# EasyEDA Pro project ProPrj_Segun O pcb_2026-03-03.epro, schematic 01POWER

## Sheets
1 01POWER: Board Name: 01POWER; Create Date: 2026-02-16; Page Name: 01POWER; Project Name: Segun O pcb fiverr; Schematic Name: 01POWER; Update Date: 2026-02-18
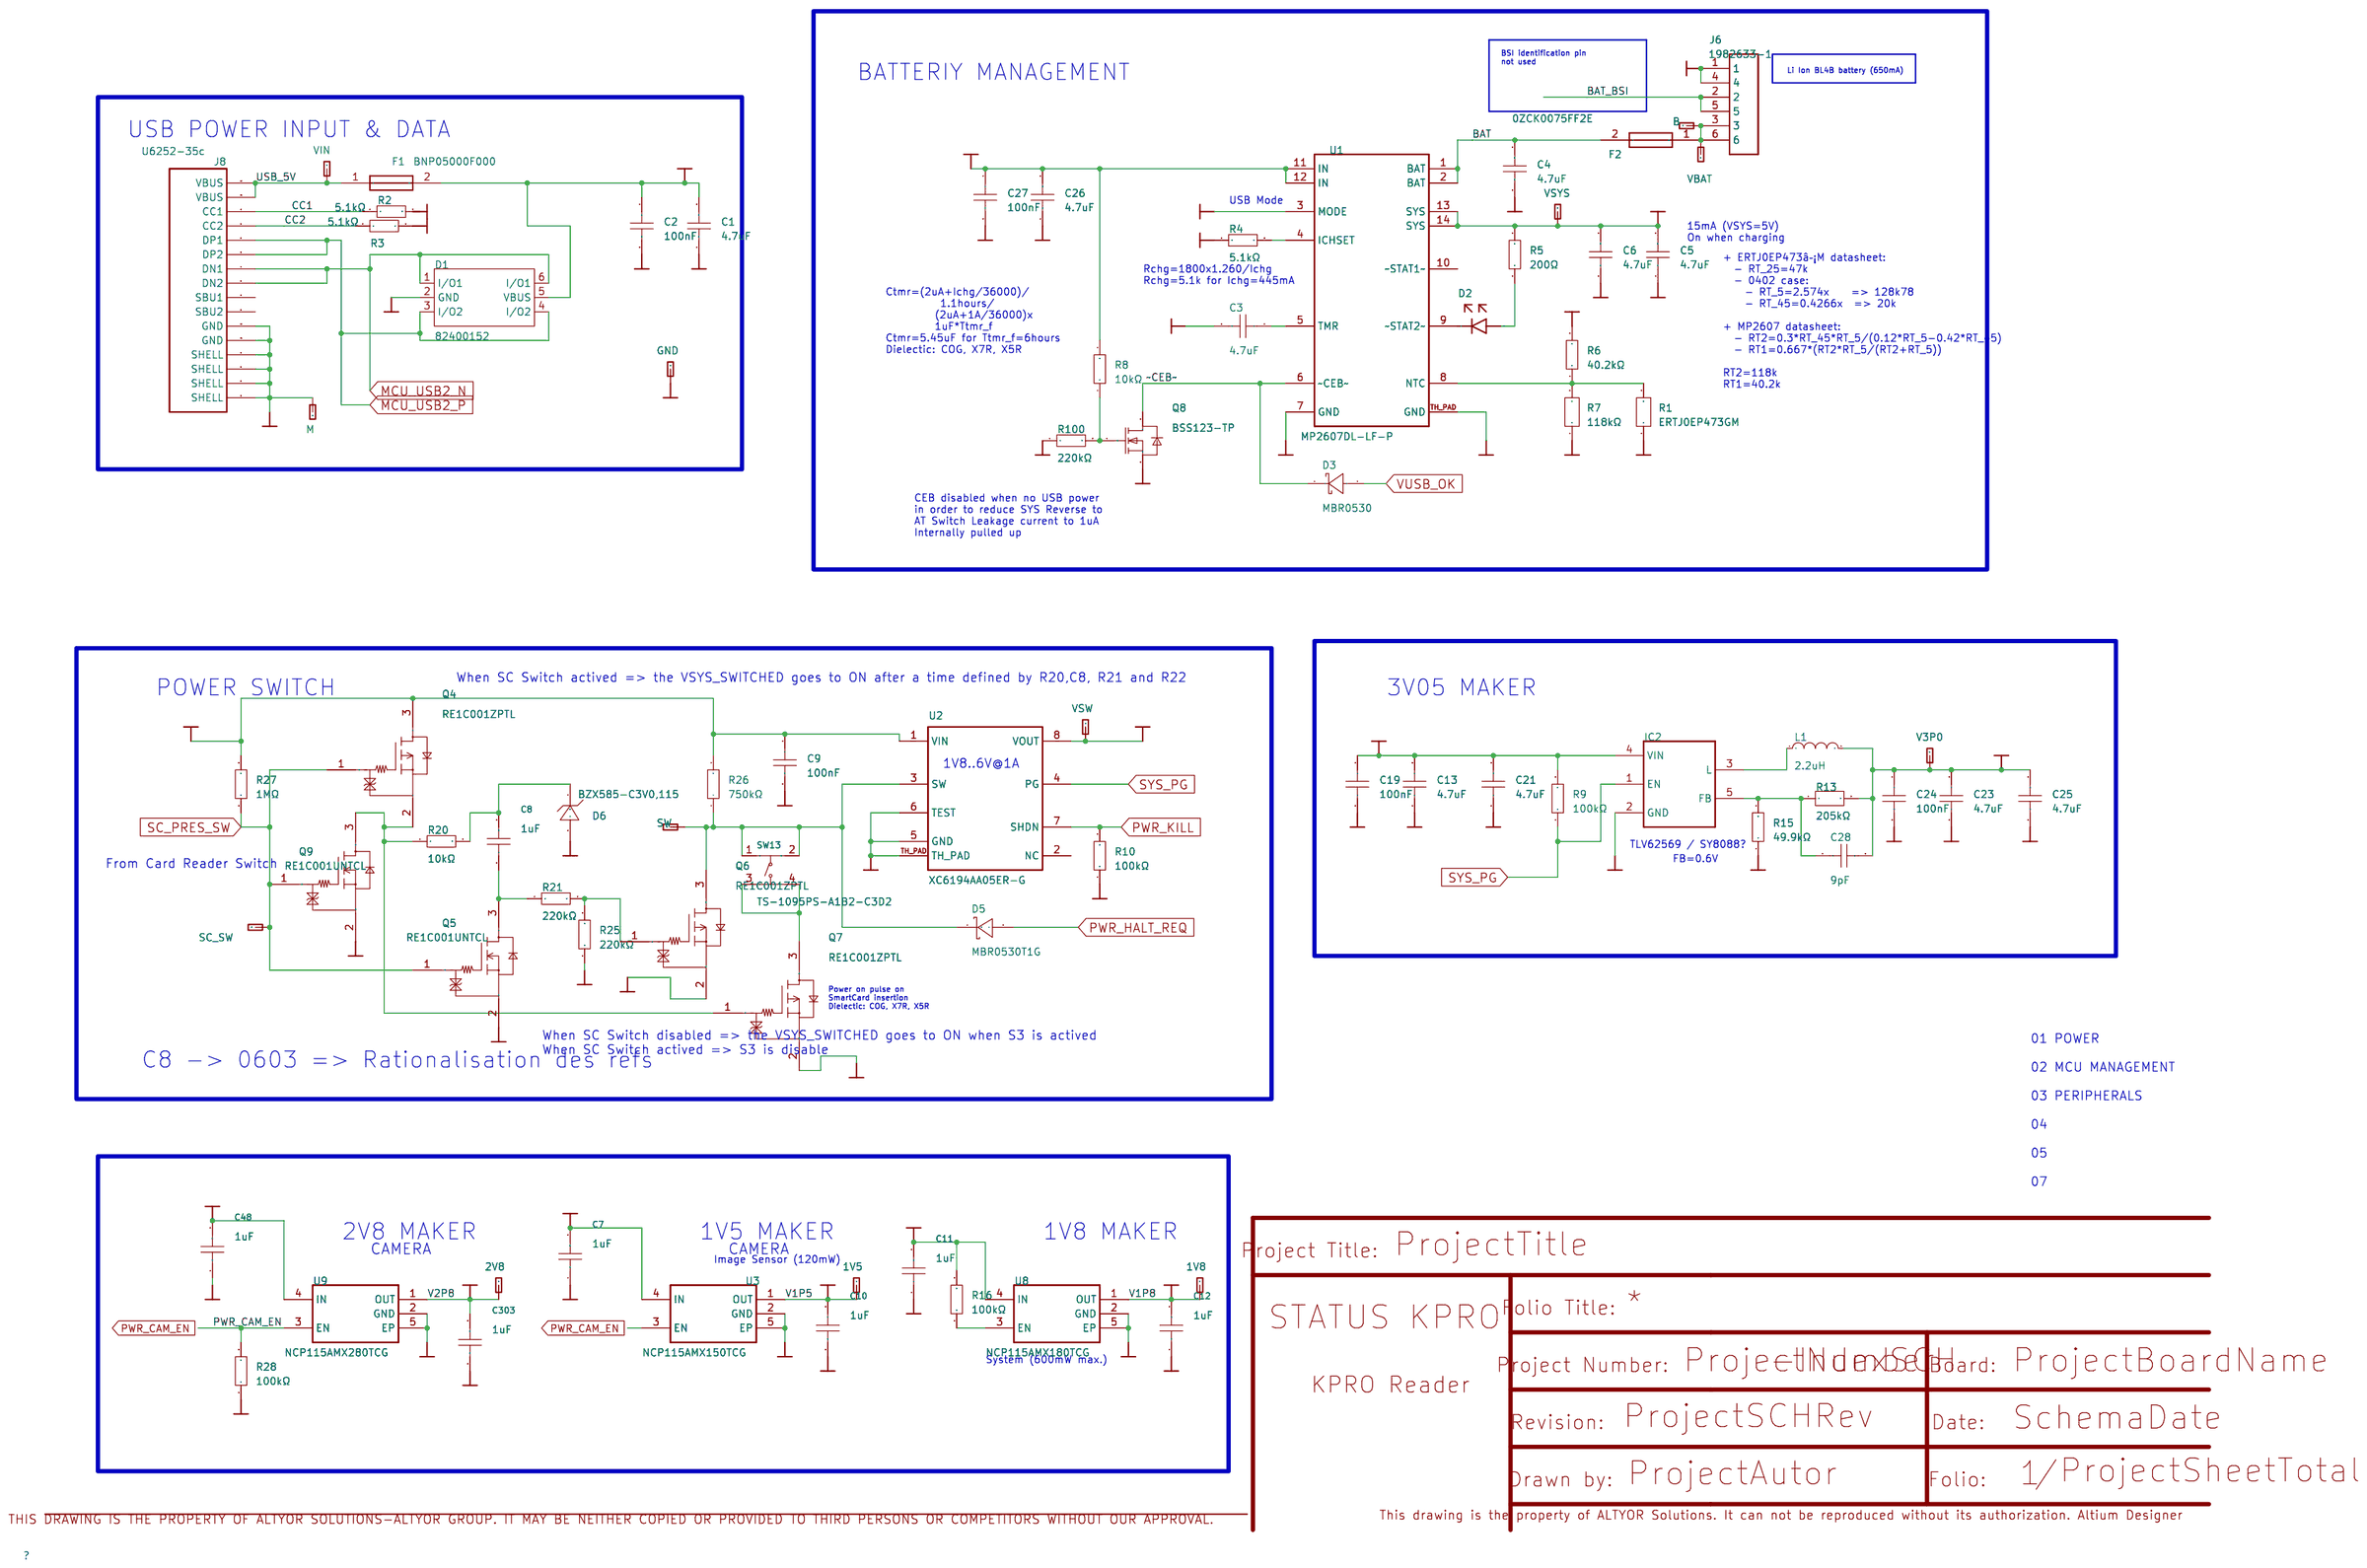
[diagram p0: 01POWER]
2 02MCU: Page Name: 02MCU; Update Date: 2026-02-16
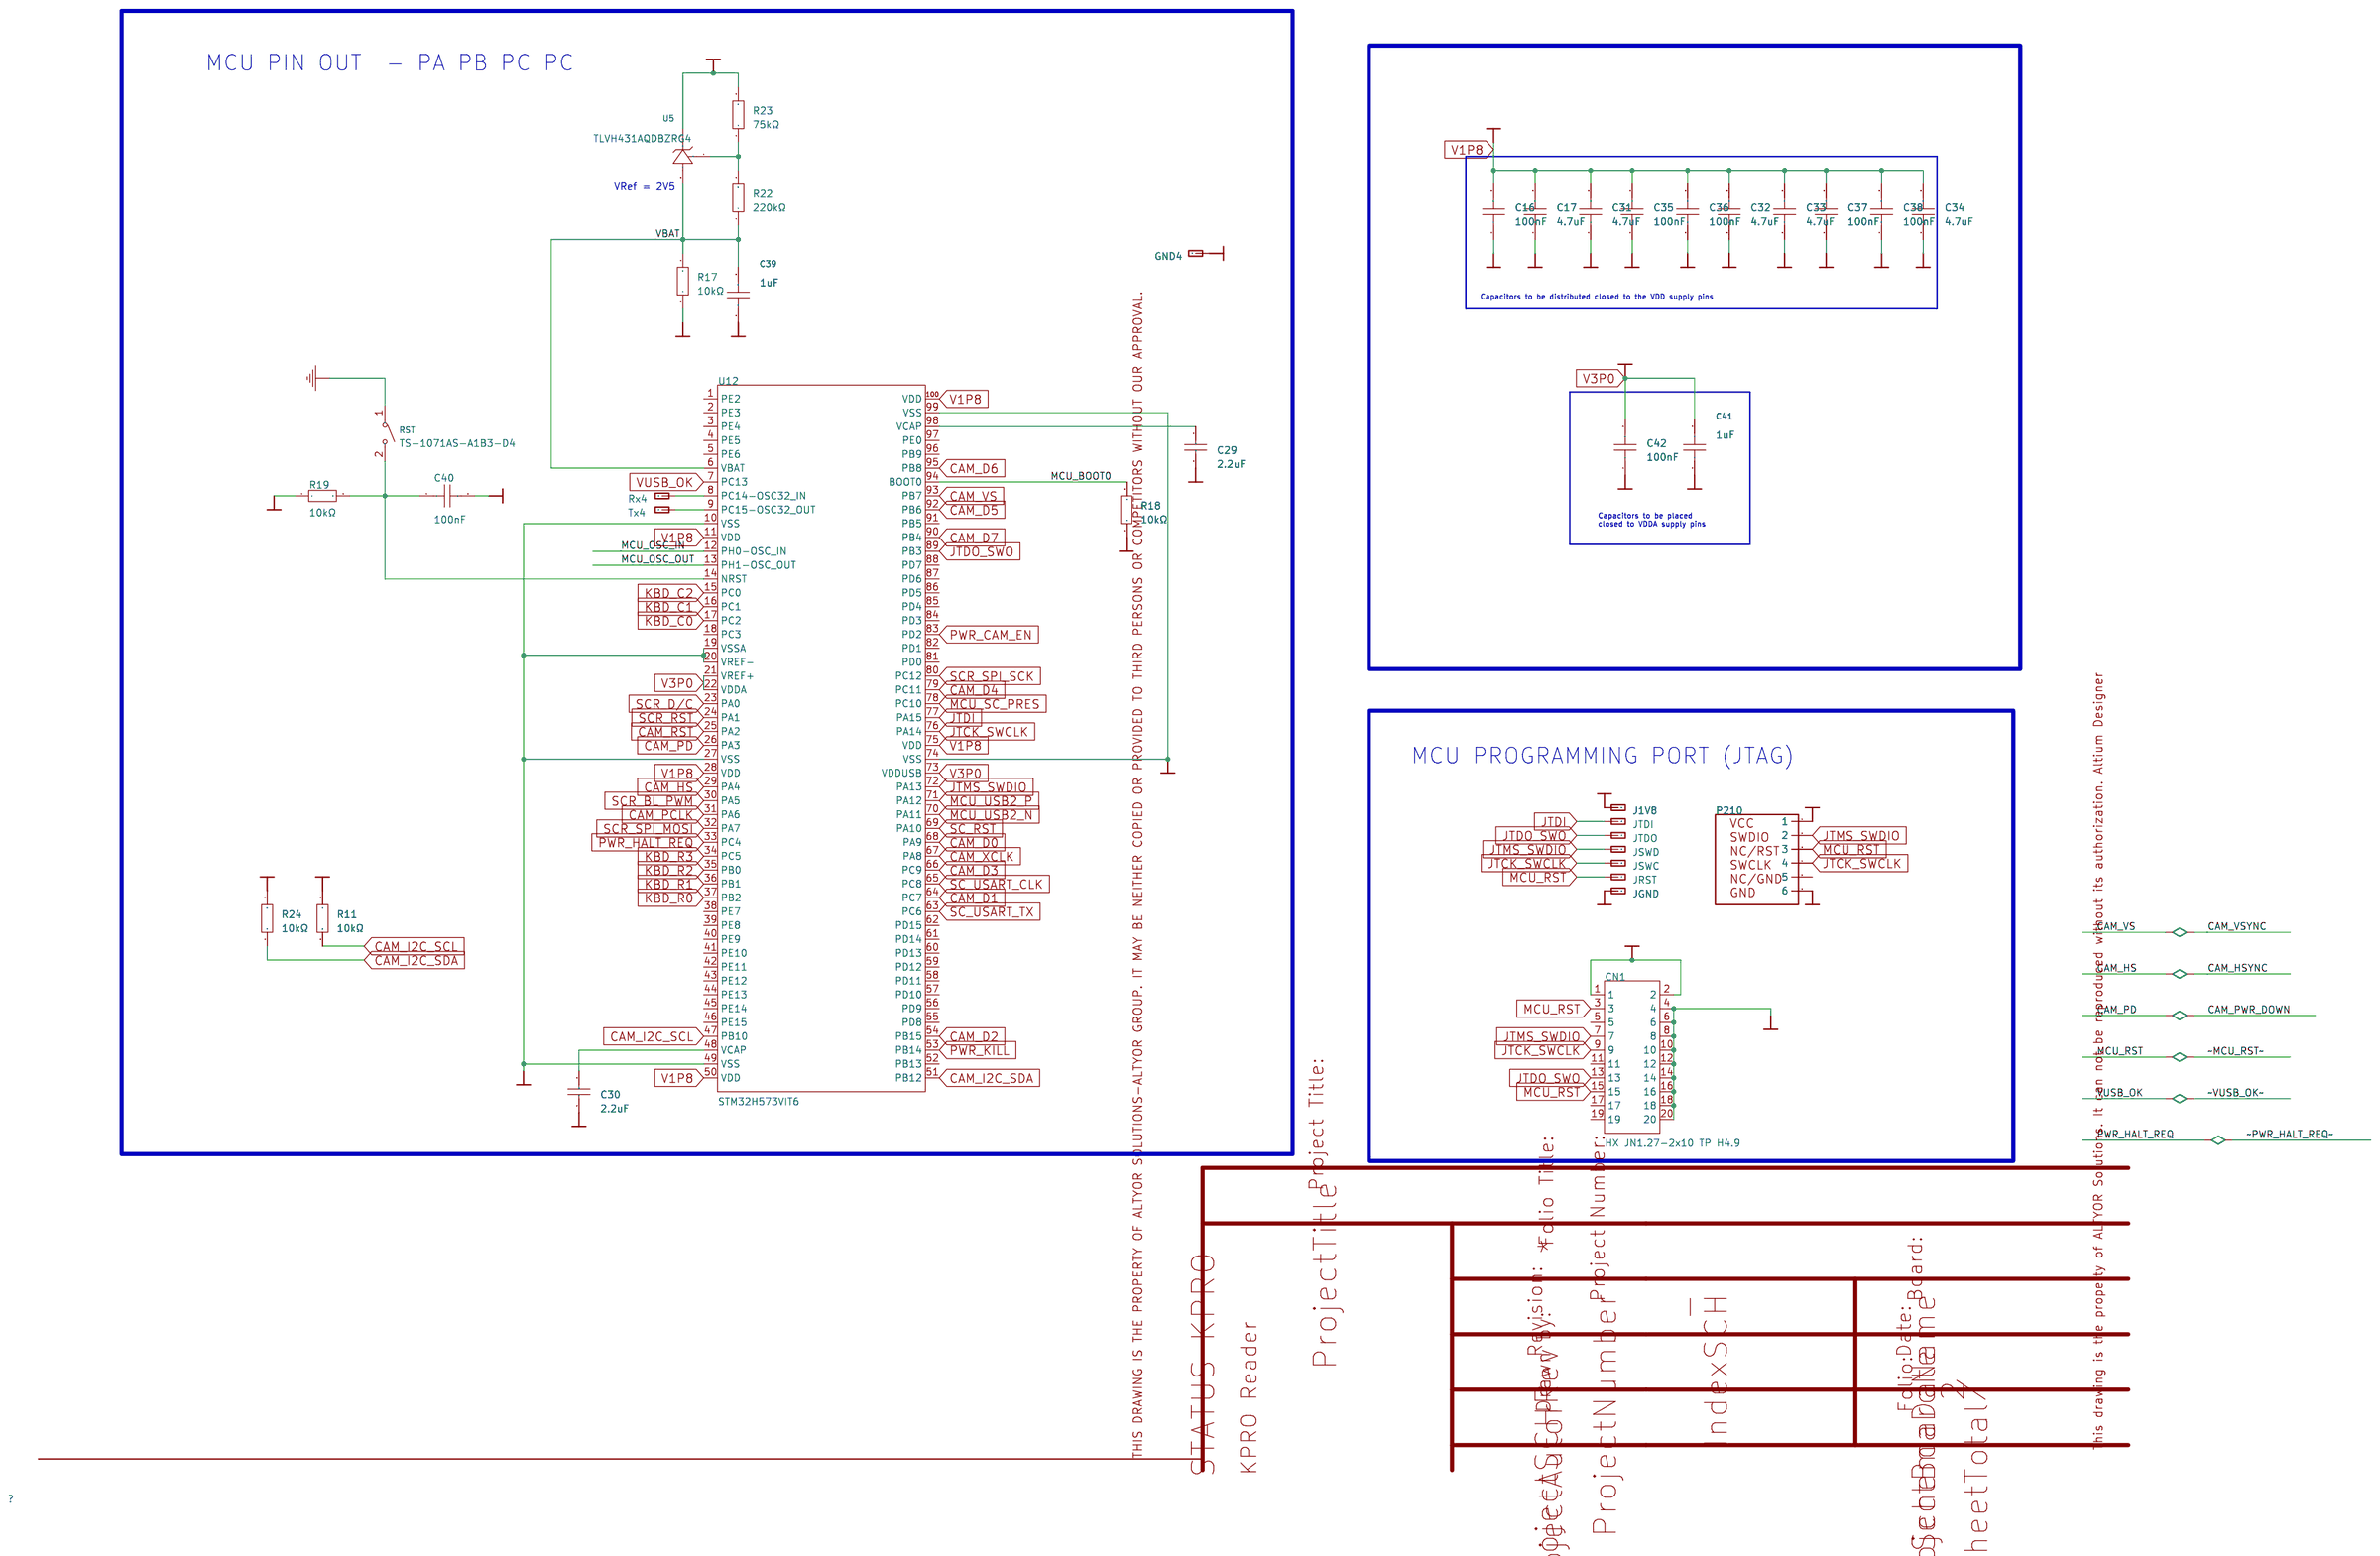
[diagram p1: 02MCU]
3 03PERIPHERALS: Page Name: 03PERIPHERALS
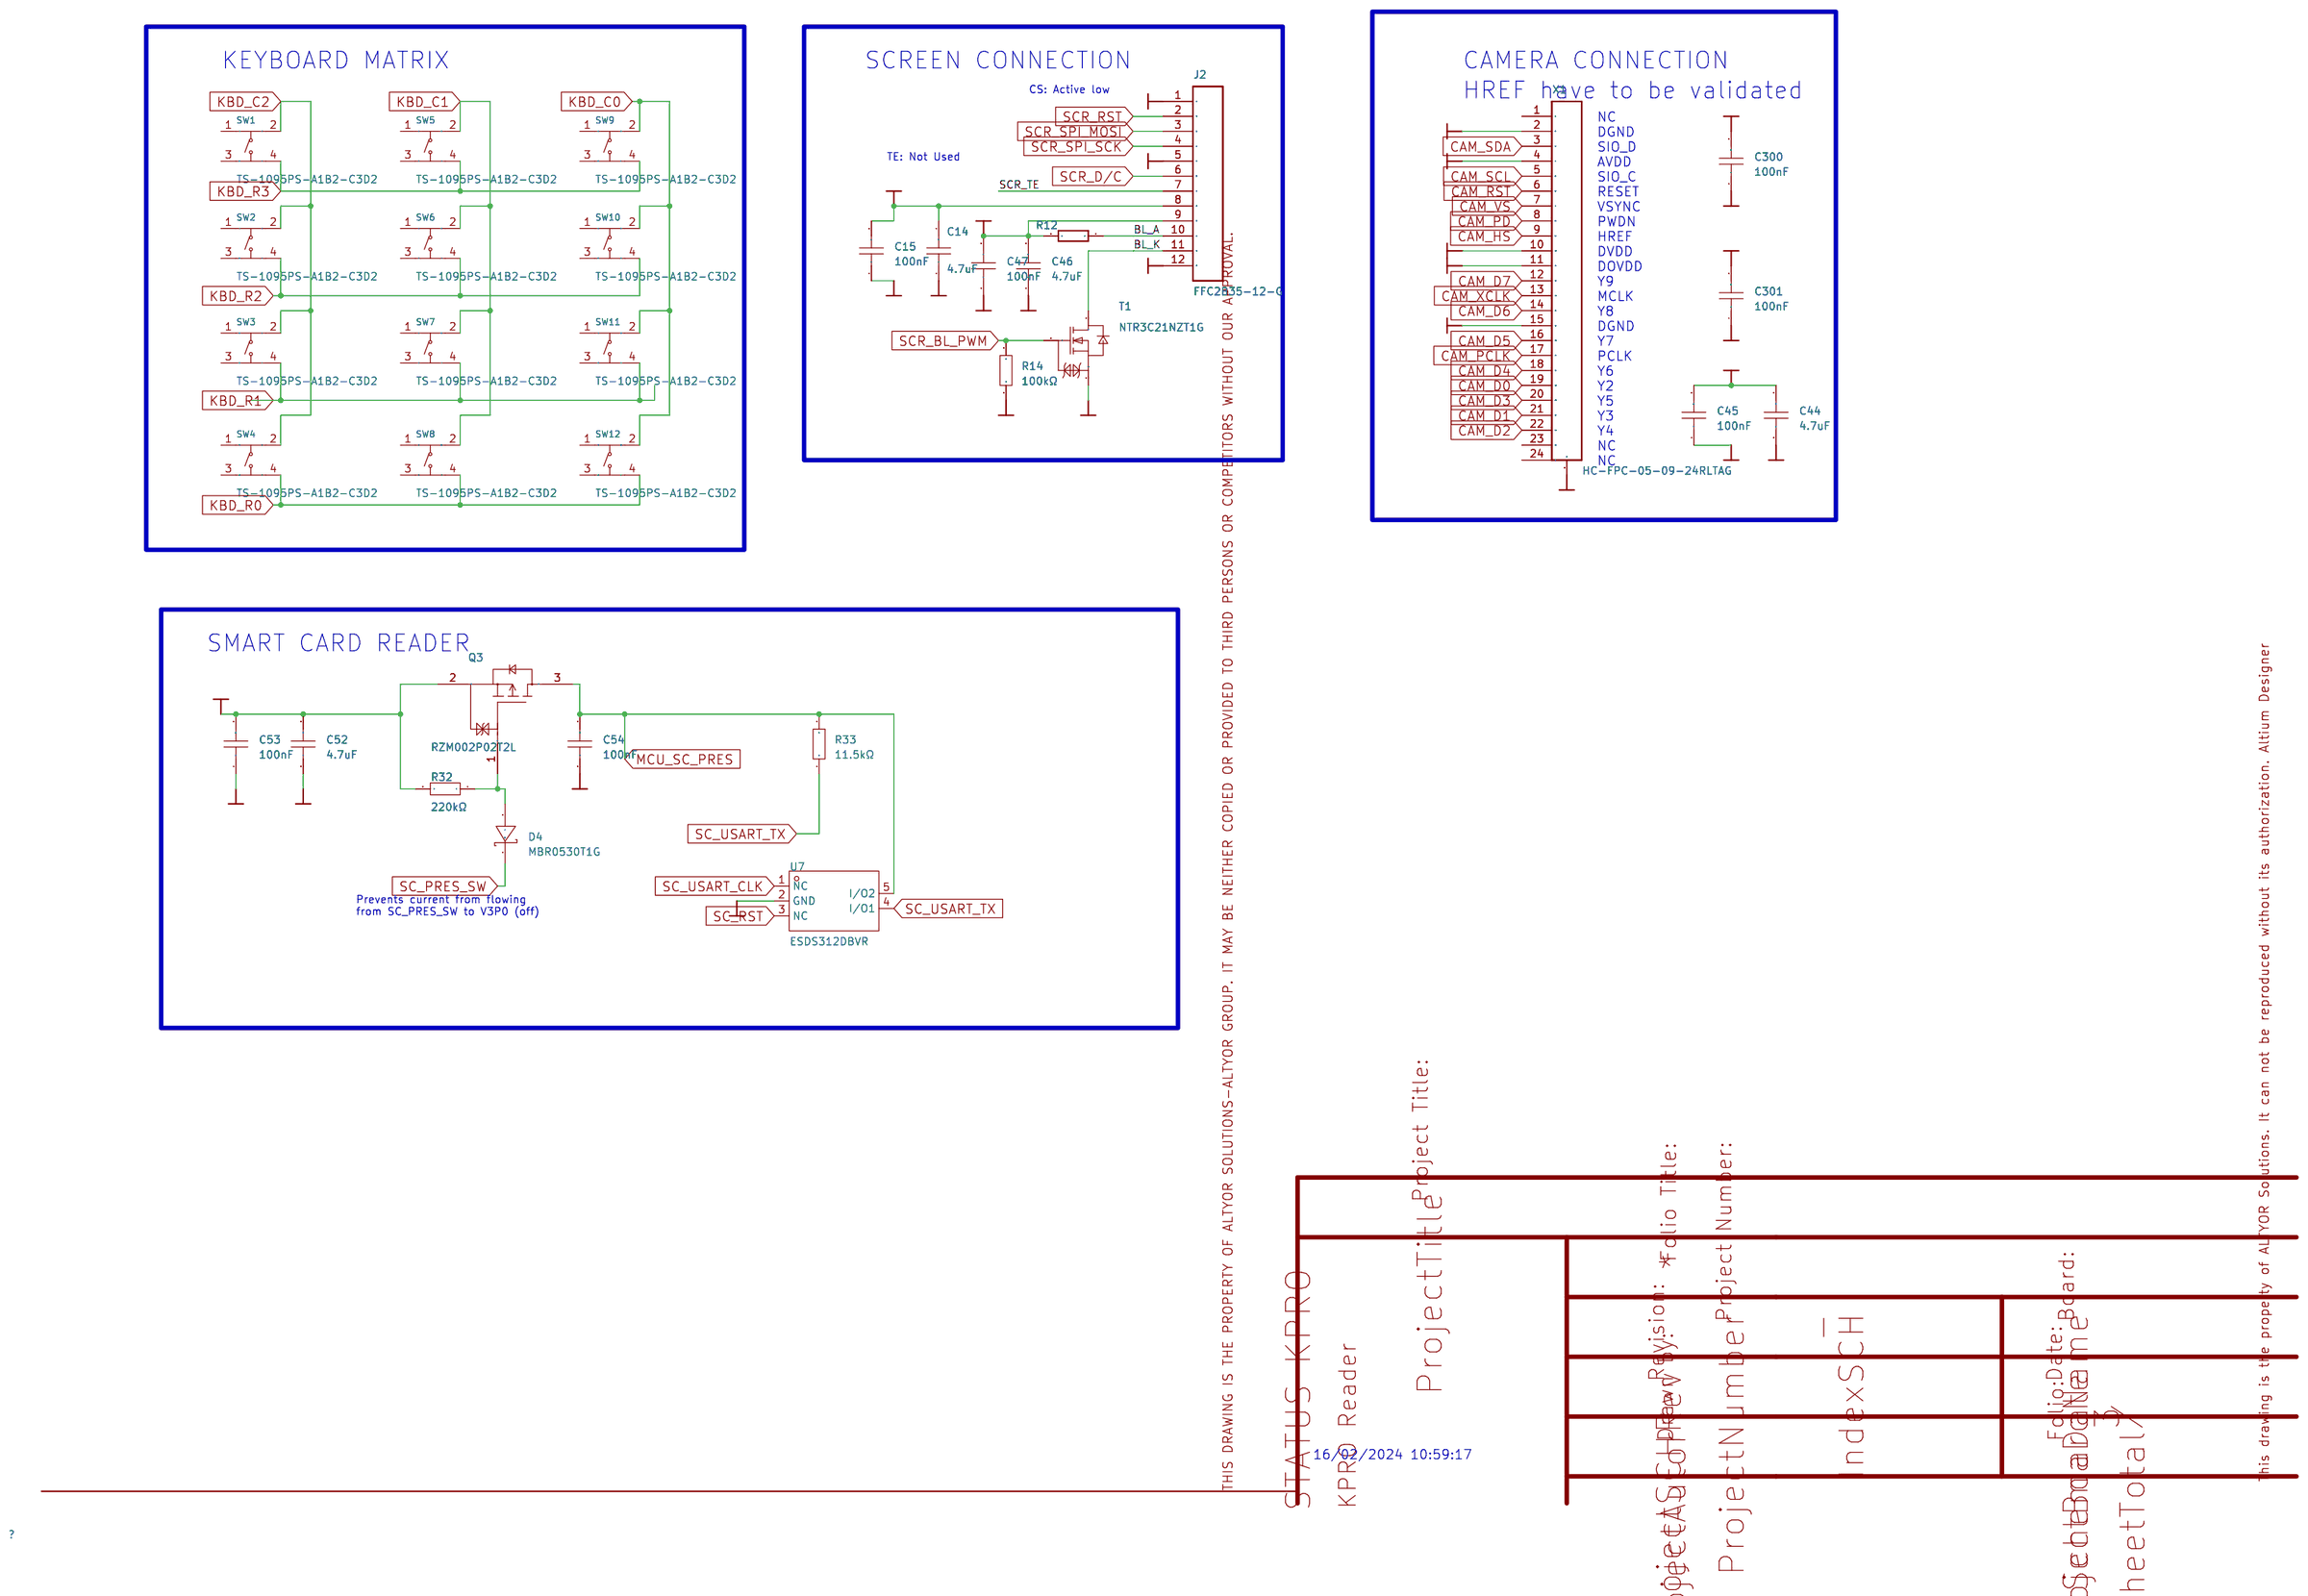
[diagram p2: 03PERIPHERALS]
4 Folio01: Page Name: Folio01
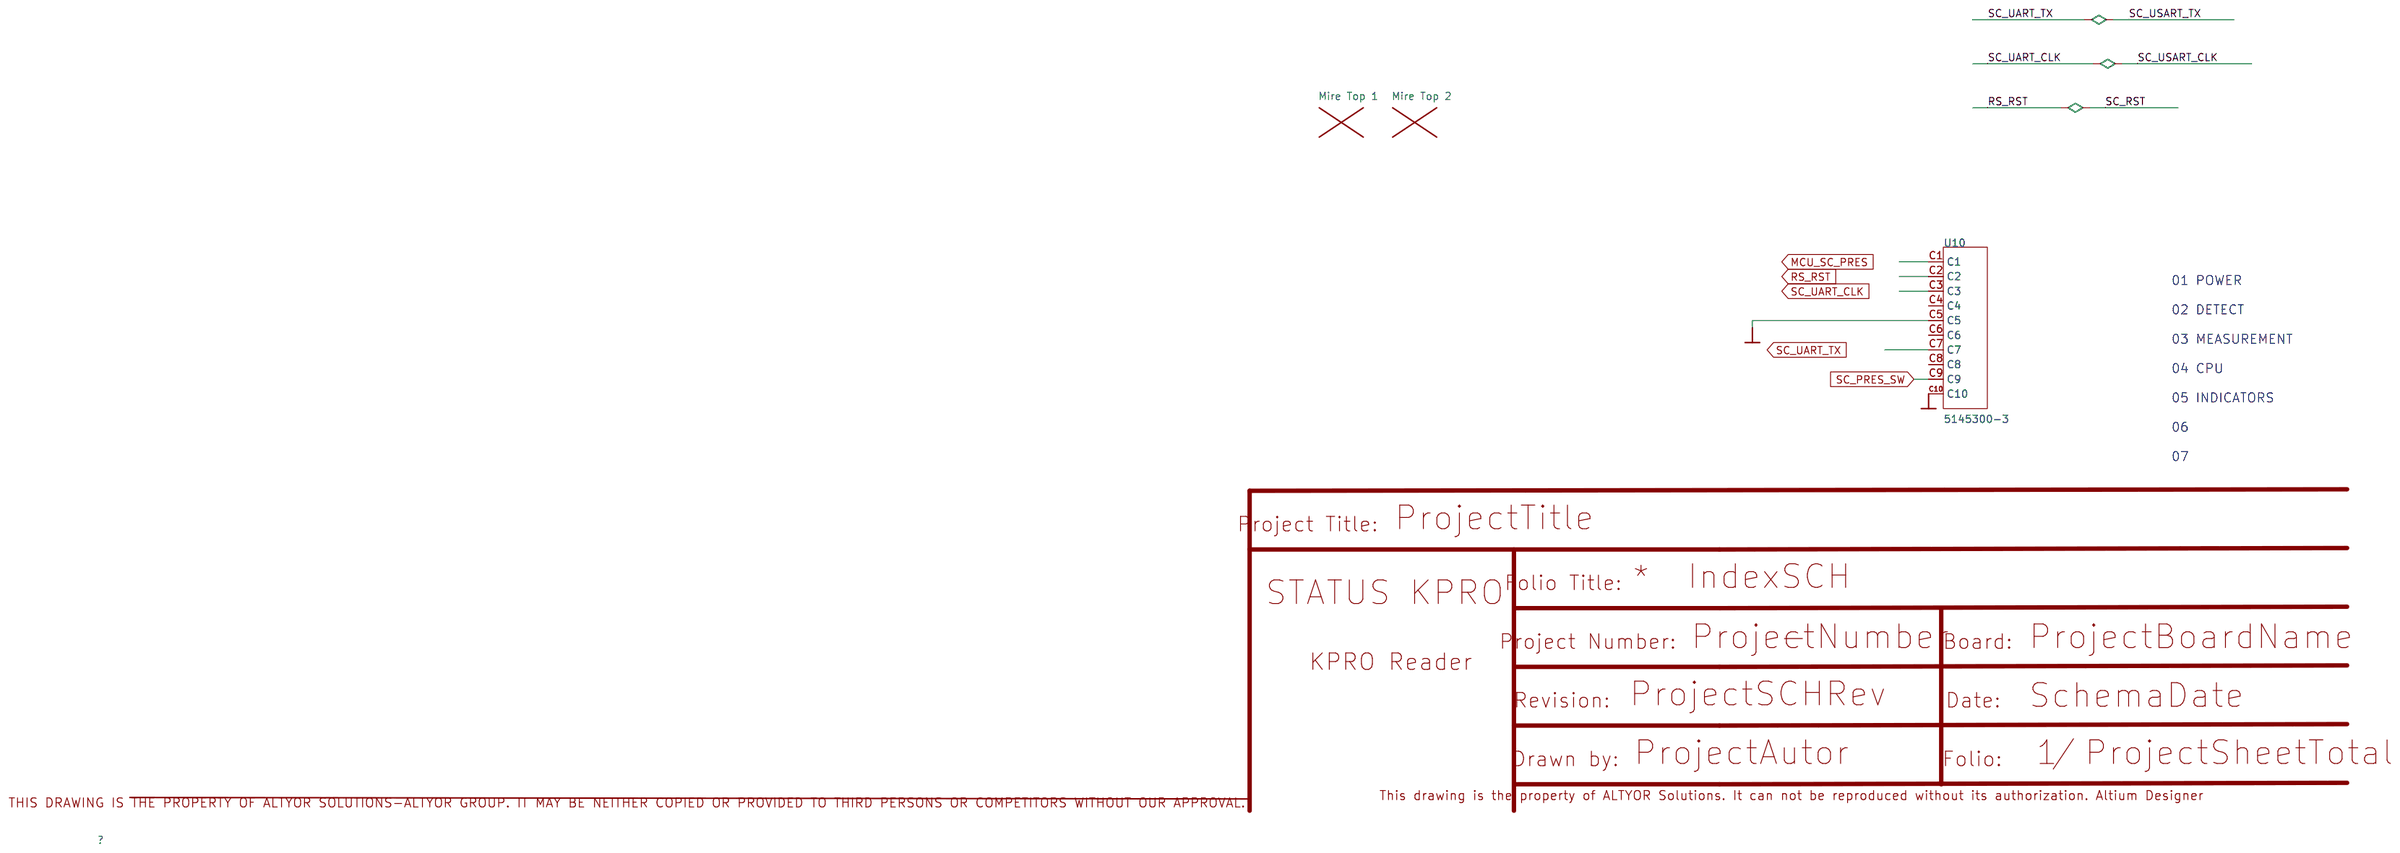
[diagram p3: Folio01]

## Parts
sheet 01POWER
1V5  TP  [TESTPOINT 1MM]
1V8  TP  [TESTPOINT 1MM]
2V8  TP  [TESTPOINT 1MM]
B  TP  [PLAGE - ROUGE]
C1  4.7uF  [C0805]
C2  100nF  [C0402]
C3  4.7uF  [C0402]
C4  4.7uF  [C0805]
C5  4.7uF  [C0805]
C6  4.7uF  [C0805]
C7  1uF  [C0603]
C8  1uF  [C0603]
C9  100nF  [C0402]
C10  1uF  [C0603]
C11  1uF  [C0603]
C12  1uF  [C0603]
C13  4.7uF  [C0805]
C19  100nF  [C0402]
C21  4.7uF  [C0805]
C23  4.7uF  [C0805]
C24  100nF  [C0402]
C25  4.7uF  [C0805]
C26  4.7uF  [C0805]
C27  100nF  [C0402]
C28  9pF  [C0402]
C48  1uF  [C0603]
C303  1uF  [C0603]
D1  82400152  [SOT-563_L1.6-W1.2-P0.50-LS1.6-BL]
D2  LR_Y8SF-U1V2-1  [OSRAM LRY8SFU1V21]
D3  MBR0530  [SOD-123_L2.7-W1.6-LS3.7-RD-1]
D5  MBR0530T1G  [SOD-123_L2.7-W1.6-LS3.7-RD-1]
D6  BZX585-C3V0,115  [SOD-523_L1.2-W0.8-LS1.6-RD]
F1  BNP05000F000  [0805 - FUSE]
F2  0ZCK0075FF2E  [0805 - FUSE]
GND  TP  [TESTPOINT 1MM]
IC2  SY8088IAAC  [SOT23-5 0.95 VAR AA]
J6  1982633-1  [TE 19826331]
J8  U6252-35c  [ANTENK U6252-35C]
L1  2.2uH  [IND-SMD_L2.5-W2.0-1]
M  TP  [PLAGE - NOIRE]
Q4  RE1C001ZPTL  [SC-89-3_L1.6-W0.9-P1.00-LS1.6-BR]
Q5  RE1C001UNTCL  [SC-89-3_L1.6-W0.9-P1.00-LS1.6-BR]
Q6  RE1C001ZPTL  [SC-89-3_L1.6-W0.9-P1.00-LS1.6-BR]
Q7  RE1C001ZPTL  [SC-89-3_L1.6-W0.9-P1.00-LS1.6-BR]
Q8  BSS123-TP  [SOT-23-3_L2.9-W1.3-P0.95-LS2.4-BR]
Q9  RE1C001UNTCL  [SC-89-3_L1.6-W0.9-P1.00-LS1.6-BR]
R1  ERTJ0EP473GM  [R0402]
R2  5.1kΩ  [R0402]
R3  5.1kΩ  [R0402]
R4  5.1kΩ  [R0402]
R5  200Ω  [R0402]
R6  40.2kΩ  [R0402]
R7  118kΩ  [R0402]
R8  10kΩ  [R0402]
R9  100kΩ  [R0402]
R10  100kΩ  [R0402]
R13  205kΩ  [R0402]
R15  49.9kΩ  [R0402]
R16  100kΩ  [R0402]
R20  10kΩ  [R0402]
R21  220kΩ  [R0402]
R25  220kΩ  [R0402]
R26  750kΩ  [R0402]
R27  1MΩ  [R0201]
R28  100kΩ  [R0402]
R100  220kΩ  [R0402]
SC_SW  TP  [TESTPOINT 1MM]
SW  TP  [TESTPOINT 1MM]
SW13  TS-1095PS-A1B2-C3D2  [KEY-SMD_4P-L6.0-W6.0-P3.90-LS9.0]
U1  MP2607DL-LF-P  [QFN14-0.5-3S4]
U2  XC6194AA05ER-G  [TOREX USP-8B06]
U3  NCP115AMX150TCG  [ON SEMI NCV8160AMX330TBG]
U8  NCP115AMX180TCG  [ON SEMI NCV8160AMX330TBG]
U9  NCP115AMX280TCG  [ON SEMI NCV8160AMX330TBG]
V3P0  TP  [TESTPOINT 1MM]
VBAT  TP  [TESTPOINT 1MM]
VIN  TP  [TESTPOINT 1MM]
VSW  TP  [TESTPOINT 1MM]
VSYS  TP  [TESTPOINT 1MM]
sheet 02MCU
C16  100nF  [C0402]
C17  4.7uF  [C0805]
C29  2.2uF  [C0805]
C30  2.2uF  [C0805]
C31  4.7uF  [C0805]
C32  4.7uF  [C0805]
C33  4.7uF  [C0805]
C34  4.7uF  [C0805]
C35  100nF  [C0402]
C36  100nF  [C0402]
C37  100nF  [C0402]
C38  100nF  [C0402]
C39  1uF  [C0603]
C40  100nF  [C0402]
C41  1uF  [C0603]
C42  100nF  [C0402]
CN1  HX JN1.27-2x10 TP H4.9  [CONN-SMD_HX-JN1.27-2X10-TP-H4.9]
GND4  TP  [TESTPOINT 1MM]
J1V8  TP  [TESTPOINT 1MM]
JGND  TP  [TESTPOINT 1MM]
JRST  TP  [TESTPOINT 1MM]
JSWC  TP  [TESTPOINT 1MM]
JSWD  TP  [TESTPOINT 1MM]
JTDI  TP  [TESTPOINT 1MM]
JTDO  TP  [TESTPOINT 1MM]
P210  TC2030-MCP-NL  [TC2030-MCP-NL]
R11  10kΩ  [R0402]
R17  10kΩ  [R0402]
R18  10kΩ  [R0402]
R19  10kΩ  [R0402]
R22  220kΩ  [R0402]
R23  75kΩ  [R0402]
R24  10kΩ  [R0402]
RST  TS-1071AS-A1B3-D4  [SW-SMD_L4.0-W3.0-LS4.8]
Rx4  TP  [TESTPOINT 1MM]
Tx4  TP  [TESTPOINT 1MM]
U5  TLVH431AQDBZRG4  [SOT-23-3_L3.0-W1.7-P0.95-LS2.9-BR]
U12  STM32H573VIT6  [LQFP-100_L14.0-W14.0-P0.50-LS16.0-BL]
sheet 03PERIPHERALS
C14  4.7uF  [C0805]
C15  100nF  [C0402]
C44  4.7uF  [C0805]
C45  100nF  [C0402]
C46  4.7uF  [C0805]
C47  100nF  [C0402]
C52  4.7uF  [C0805]
C53  100nF  [C0402]
C54  100nF  [C0402]
C300  100nF  [C0402]
C301  100nF  [C0402]
D4  MBR0530T1G  [SOD-123_L2.7-W1.6-LS3.7-RD-1]
J2  FFC2B35-12-G  [GCT FFC2B35-12-G]
Q3  RZM002P02T2L  [SOT-723_L1.2-W0.8-P0.40-LS1.2-BR]
R12  RC0402FR-0710RL  [0402 - RESISTOR]
R14  100kΩ  [R0402]
R32  220kΩ  [R0402]
R33  11.5kΩ  [R0402]
SW1  TS-1095PS-A1B2-C3D2  [KEY-SMD_4P-L6.0-W6.0-P3.90-LS9.0]
SW2  TS-1095PS-A1B2-C3D2  [KEY-SMD_4P-L6.0-W6.0-P3.90-LS9.0]
SW3  TS-1095PS-A1B2-C3D2  [KEY-SMD_4P-L6.0-W6.0-P3.90-LS9.0]
SW4  TS-1095PS-A1B2-C3D2  [KEY-SMD_4P-L6.0-W6.0-P3.90-LS9.0]
SW5  TS-1095PS-A1B2-C3D2  [KEY-SMD_4P-L6.0-W6.0-P3.90-LS9.0]
SW6  TS-1095PS-A1B2-C3D2  [KEY-SMD_4P-L6.0-W6.0-P3.90-LS9.0]
SW7  TS-1095PS-A1B2-C3D2  [KEY-SMD_4P-L6.0-W6.0-P3.90-LS9.0]
SW8  TS-1095PS-A1B2-C3D2  [KEY-SMD_4P-L6.0-W6.0-P3.90-LS9.0]
SW9  TS-1095PS-A1B2-C3D2  [KEY-SMD_4P-L6.0-W6.0-P3.90-LS9.0]
SW10  TS-1095PS-A1B2-C3D2  [KEY-SMD_4P-L6.0-W6.0-P3.90-LS9.0]
SW11  TS-1095PS-A1B2-C3D2  [KEY-SMD_4P-L6.0-W6.0-P3.90-LS9.0]
SW12  TS-1095PS-A1B2-C3D2  [KEY-SMD_4P-L6.0-W6.0-P3.90-LS9.0]
T1  NTR3C21NZT1G  [SOT-23-3_L2.9-W1.6-P1.90-LS2.8-BR]
U7  ESDS312DBVR  [SOT-23-5_L2.9-W1.6-P0.95-LS2.8-TL]
X1  HC-FPC-05-09-24RLTAG  [HCTL HC-FPC-05-09-24RLTAG]
sheet Folio01
Mire Top 1  DNI  [MIRE]
Mire Top 2  DNI  [MIRE]
U10  5145300-3  [SD-SMD_5145300-3]

## Library data of the parts
1V5 1V8 2V8 B GND GND4 J1V8 JGND JRST JSWC JSWD JTDI JTDO M Rx4 SC_SW SW Tx4 V3P0 VBAT VIN VSW VSYS = TP: Pointe de test 1.27mm; LIBRARY REFERENCE: TP 1.27mm; ERP CODE: 10-*; ERP SF CODE: 16; TMAX: N/A; TMIN: N/A; GENERIC: False; Library Name: KCP-2282-600
C1 C4-C6 C13 C14 C17 C21 C23 C25 C26 C31-C34 C44 C46 C52 = 0805X475M250NT: Capacitance:4.7uF Tolerance:±20% Tolerance:±20% Voltage Rating:25V Temperature Coefficient:X5R; LCSC Part Name: 4.7uF ±20% 25V; Supplier Part: C2857998; Manufacturer: FH(风华); Supplier Footprint: 0805; JLCPCB Part Class: Extended Part; Datasheet: https://item.szlcsc.com/datasheet/0805X475M250NT/3058809.html; Supplier: LCSC; Tolerance: ±20%; Voltage Rating: 25V; Temperature Coefficient: X5R
C2 C9 C15 C16 C19 C24 C27 C35-C38 C40 C42 C45 C47 C53 C54 C300 C301 = 0402B104K500CT: Capacitance:100nF Tolerance:±10% Tolerance:±10% Voltage Rating:50V Temperature Coefficient:X7R; LCSC Part Name: 100nF ±10% 50V; Supplier Part: C152814; Manufacturer: Walsin(华新科); Supplier Footprint: 0402; Datasheet: https://item.szlcsc.com/datasheet/0402B104K500CT/164155.html; Supplier: LCSC; Tolerance: ±10%; Voltage Rating: 50V; Temperature Coefficient: X7R
C3 = CC0402KRX5R6BB475: Capacitance:4.7uF Tolerance:±10% Tolerance:±10% Voltage Rating:10V Temperature Coefficient:X5R; LCSC Part Name: 4.7uF ±10% 10V; Supplier Part: C326586; Manufacturer: YAGEO(国巨); Supplier Footprint: 0402; Datasheet: https://item.szlcsc.com/datasheet/CC0402KRX5R6BB475/306680.html; Supplier: LCSC; Tolerance: ±10%; Voltage Rating: 10V; Temperature Coefficient: X5R
C7 C8 C10-C12 C39 C41 C48 C303 = 0603X105K500CT: Capacitance: Tolerance:±10% Tolerance:±10% Voltage Rated: Temperature Coefficient:; LCSC Part Name: 1uF ±10% 50V; Supplier Part: C141872; Manufacturer: Walsin(华新科); Supplier Footprint: 0603; Datasheet: https://atta.szlcsc.com/upload/public/pdf/source/20181012/C171757_24195D90CC6BA860ED294A8E1EED20EE.pdf; Supplier: LCSC; Tolerance: ±10%
C28 = GJM1555C1H9R0CB01D: Capacitance:9pF Voltage Rating:50V Temperature Coefficient:C0G; LCSC Part Name: ±0.25pF 9pF 50V; Supplier Part: C85884; Manufacturer: muRata(村田); Supplier Footprint: 0402; Datasheet: https://item.szlcsc.com/datasheet/GJM1555C1H9R0CB01D/87060.html; Supplier: LCSC; Voltage Rating: 50V; Temperature Coefficient: C0G
D1 = 82400152_C22435121: Reverse Stand-Off Voltage (Vrwm):5V Clamping Voltage:16V Peak Pulse Current (Ipp):5A@8/20us Peak Pulse Power Dissipation (Ppp):100W@8/20us Voltage - Breakdown:6.5V Reverse Leakage Current (Ir):100nA level of protection:IEC 61000-4-2；IEC 61000-4-4；IEC 6100; LCSC Part Name: 低电容TVS二极管阵列; Supplier Part: C22435121; Manufacturer: TECH PUBLIC(台舟); Supplier Footprint: SOT-563; JLCPCB Part Class: Extended Part; Datasheet: https://item.szlcsc.com/datasheet/82400152/24062289.html; Supplier: LCSC; Reverse Stand-Off Voltage (Vrwm): 5V; Clamping Voltage: 16V; Peak Pulse Current (Ipp): 5A@8/20us; Peak Pulse Power Dissipation (Ppp): 100W@8/20us; Voltage - Breakdown: 6.5V; Reverse Leakage Current (Ir): 100nA; level of protection: IEC 61000-4-2；IEC 61000-4-4；IEC 61000-4-5; Junction Capacitance: 0.8pF；0.3pF
D2 = LR_Y8SF-U1V2-1: Osram Opto Micro SIDELED Series Red LED, 120    Source:  Datasheet; TMIN: -40; TMAX: 100; ARTICLE CODE: MSR 720-LRY8SFU1V21; ERP CODE: 10-*; ERP SF CODE: 5; MANUFACTURER: OSRAM; GENERIC: Flase; Library Name: KCP-2282-600
D3 = MBR0530_C699108: Voltage - Forward(Vf@If):550mV@500mA Voltage - DC Reverse(Vr):30V Current - Rectified:500mA Reverse Leakage Current (Ir):100uA@30V Operating Junction Temperature Range:-55℃~+125℃ Operating Junction Temperature Range:-55℃~+125℃ Non-Repetitive Peak Forward; LCSC Part Name: 电压:30V 电流:500mA; Supplier Part: C699108; Manufacturer: YANGJIE(扬杰); Supplier Footprint: SOD-123; JLCPCB Part Class: Extended Part; Datasheet: https://item.szlcsc.com/datasheet/MBR0530/733800.html; Supplier: LCSC; Voltage - Forward(Vf@If): 550mV@500mA; Voltage - DC Reverse(Vr): 30V; Current - Rectified: 500mA; Reverse Leakage Current (Ir): 100uA@30V; Operating Junction Temperature Range: -55℃~+125℃; Non-Repetitive Peak Forward Surge Current: 5.5A
D4 D5 = MBR0530T1G: Voltage - Forward(Vf@If):430mV@500mA Voltage - DC Reverse(Vr):30V Current - Rectified:500mA Reverse Leakage Current (Ir):130uA@30V Operating Junction Temperature Range:-65℃~+125℃ Operating Junction Temperature Range:-65℃~+125℃ Non-Repetitive Peak Forward; LCSC Part Name: 电压:30V 电流:500mA; Supplier Part: C82046; Manufacturer: onsemi(安森美); Supplier Footprint: SOD-123; JLCPCB Part Class: Extended Part; Datasheet: https://item.szlcsc.com/datasheet/MBR0530T1G/83201.html; Supplier: LCSC; Voltage - Forward(Vf@If): 430mV@500mA; Voltage - DC Reverse(Vr): 30V; Current - Rectified: 500mA; Reverse Leakage Current (Ir): 130uA@30V; Operating Junction Temperature Range: -65℃~+125℃; Non-Repetitive Peak Forward Surge Current: 5.5A
D6 = BZX585-C3V0,115: Diode Configuration:1 Independent Zener Voltage(Nom):3V Reverse Leakage Current (Ir):10uA@1V Zener Voltage(Range):2.85V~3.15V Zener Voltage(Range):2.85V~3.15V Pd - Power Dissipation:300mW Impedance(Zzt):95Ω Operating Junction Temperature Range:-65℃~+150℃; LCSC Part Name: 稳压二极管; Supplier Part: C550648; Manufacturer: Nexperia(安世); Supplier Footprint: SOD-523(SC-79); JLCPCB Part Class: Extended Part; Datasheet: https://item.szlcsc.com/datasheet/BZX585-C3V0%252C115/571729.html; Supplier: LCSC; Diode Configuration: 1 Independent; Zener Voltage(Nom): 3V; Reverse Leakage Current (Ir): 10uA@1V; Zener Voltage(Range): 2.85V~3.15V; Pd - Power Dissipation: 300mW; Impedance(Zzt): 95Ω; Operating Junction Temperature Range: -65℃~+150℃
F1 = BNP05000F000: FUSE 500mA 6V 0805; MANUFACTURE_CND: '0ZCK0050FF2E/0402L050SLKR; ARTICLE CODE: 530-0ZCK0050FF2E; TMIN: -40; ERP CODE: 10-*; MANUFACTURER: JNHONGBAO; GENERIC: False; TMAX: 85; Design Item ID: 0ZCK0050FF2E; Library Name: KCP-2282-600
F2 = 0ZCK0075FF2E: PTC Resettable Fuse 0.75A(hold) 1.5A(trip) 6VDC 40A 0.6W 0.2s 0.09Ohm SMD Solder Pad 0805 T/R Automotive   Source:  Datasheet; TMIN: -40; TMAX: 85; ARTICLE CODE: MSR 530-0ZCK0075FF2E; GENERIC: False; MANUFACTURER: Bel Circuit Protection; ERP CODE: 10-*; Library Name: KCP-2282-600
IC2 = SY8088IAAC: DCDC 2V5..5V5  50µA 1V8..3V3; GENERIC: False; TMAX: 85; ARTICLE CODE: LCSC C479072; TMIN: -40; ERP SF CODE: *; MANUFACTURER: SILERGY; Design Item ID: SILERGY SI8088IAAC; Library Name: KCP-2282-600
J6 = 1982633-1: Connecteurs carte Ã  carte et mezzanine BATTERY CONN 3 POSITION; TMIN: -20; TMAX: 80; ARTICLE CODE: MSR 571-1982633-1; GENERIC: False; MANUFACTURER: TE Connectivity; ERP CODE: 10-*; Library Name: KCP-2282-600
J8 = U6252-35c: Connecteurs USB USB C Rec 16P 3u" Mid Mnt 1.6mm O-set SMT L = 6.5mm S-Spring; MANUFACTUR_CND: GSB1C4621DS1HR; TMAX: 85; GENERIC: False; ERP CODE: 10-*; MANUFACTURER: ANTENK; TMIN: -25; Design Item ID: ANTENK U6252-35c; Library Name: KCP-2282-600
L1 = BWVF002520122R2M00: Inductance:2.2uH Tolerance:±20% Tolerance:±20% Current Rating:1.8A Current - Saturation(Isat):1.8A DC Resistance(DCR):80mΩ Type:Magnetic Shielded Inductor; LCSC Part Name: 2.2uH ±20% 1.8A; Supplier Part: C2838263; Manufacturer: Chilisin(奇力新); Supplier Footprint: 1008; Datasheet: https://item.szlcsc.com/datasheet/BWVF002520122R2M00/3012588.html; Supplier: LCSC; Tolerance: ±20%; Current Rating: 1.8A; Current - Saturation(Isat): 1.8A; DC Resistance(DCR): 80mΩ; Type: Magnetic Shielded Inductor
Q4 Q6 Q7 = RE1C001ZPTL: Number:1 P-Channel Drain to Source Voltage:20V Current - Continuous Drain(Id):100mA RDS(on):3.8Ω@4.5V,100mA Pd - Power Dissipation:150mW Gate Threshold Voltage (Vgs(th)):300mV Gate Charge(Qg):- Input Capacitance(Ciss):15pF Reverse Transfer Capacitance (Cr; LCSC Part Name: 1个P沟道 耐压:20V 电流:100mA; Supplier Part: C703629; Manufacturer: ROHM(罗姆); Supplier Footprint: SC-89; Datasheet: https://item.szlcsc.com/datasheet/RE1C001ZPTL/739440.html; Supplier: LCSC; Number: 1 P-Channel; Drain to Source Voltage: 20V; Current - Continuous Drain(Id): 100mA; RDS(on): 3.8Ω@4.5V,100mA; Pd - Power Dissipation: 150mW; Gate Threshold Voltage (Vgs(th)): 300mV; Input Capacitance(Ciss): 15pF; Reverse Transfer Capacitance (Crss@Vds): 1.5pF; Operating Temperature: -55℃~+150℃
Q5 Q9 = RE1C001UNTCL: Number:1 N-Channel Drain to Source Voltage:20V Current - Continuous Drain(Id):100mA RDS(on):3.5Ω@4.5V Pd - Power Dissipation:150mW Gate Threshold Voltage (Vgs(th)):1V@100uA Input Capacitance(Ciss):7.1pF Reverse Transfer Capacitance (Crss@Vds):1.7pF Operat; LCSC Part Name: 1个N沟道 耐压:20V 电流:100mA; Supplier Part: C253519; Manufacturer: ROHM(罗姆); Supplier Footprint: SOT-416FL; JLCPCB Part Class: Extended Part; Datasheet: https://item.szlcsc.com/datasheet/RE1C001UNTCL/248209.html; Supplier: LCSC; Number: 1 N-Channel; Drain to Source Voltage: 20V; Current - Continuous Drain(Id): 100mA; RDS(on): 3.5Ω@4.5V; Pd - Power Dissipation: 150mW; Gate Threshold Voltage (Vgs(th)): 1V@100uA; Input Capacitance(Ciss): 7.1pF; Reverse Transfer Capacitance (Crss@Vds): 1.7pF; Operating Temperature: -55℃~+150℃; Type: N-Channel; Output Capacitance(Coss): 3.3pF
Q8 = BSS123-TP: Number:1 N-Channel Drain to Source Voltage:100V Current - Continuous Drain(Id):170mA RDS(on):6Ω@10V,170mA Pd - Power Dissipation:350mW Gate Threshold Voltage (Vgs(th)):1V Gate Charge(Qg):2nC@10V Input Capacitance(Ciss):60pF@25V Reverse Transfer Capacitanc; LCSC Part Name: 1个N沟道 耐压:100V; Supplier Part: C6521970; Manufacturer: MCC(美微科); Supplier Footprint: SOT-23; Datasheet: https://item.szlcsc.com/datasheet/BSS123-TP/7475168.html; Supplier: LCSC; Number: 1 N-Channel; Drain to Source Voltage: 100V; Current - Continuous Drain(Id): 170mA; RDS(on): 6Ω@10V,170mA; Pd - Power Dissipation: 350mW; Gate Threshold Voltage (Vgs(th)): 1V; Gate Charge(Qg): 2nC@10V; Input Capacitance(Ciss): 60pF@25V; Reverse Transfer Capacitance (Crss@Vds): 6pF@25V; Operating Temperature: -55℃~+150℃@(Tj)
R1 = ERTJ0EP473GM: Resistance @ 25℃: B Constant (25℃/50℃): Resistance Tolerance: B Constant (25℃/75℃):- B Constant (25℃/85℃):4100K B Constant (25℃/100℃):- Power: B Constant Tolerance: Steady State Current (Max):- Operating Temperature:-40℃~+150℃ Operating Temperature:-40℃~+; LCSC Part Name: 47kΩ 电阻精度:±2% 4050K; Supplier Part: C336818; Manufacturer: PANASONIC(松下); Supplier Footprint: 0402; Datasheet: https://atta.szlcsc.com/upload/public/pdf/source/20200515/C336818_004B4ED78297A1741FE5637305D6F19D.pdf; Supplier: LCSC; B Constant (25℃/85℃): 4100K; Operating Temperature: -40℃~+150℃
R2-R4 = RC0402FR-075K1L: Type:Thick Film Resistor Resistance:5.1kΩ Tolerance:±1% Tolerance:±1% Power(Watts):62.5mW Voltage-Supply(Max):50V Temperature Coefficient:±100ppm/℃ Temperature Coefficient:±100ppm/℃ Operating Temperature:-55℃~+155℃ Operating Temperature:-55℃~+155℃; LCSC Part Name: 厚膜电阻 5.1kΩ ±1% 62.5mW; Supplier Part: C105872; Manufacturer: YAGEO(国巨); Supplier Footprint: 0402; JLCPCB Part Class: Extended Part; Datasheet: https://item.szlcsc.com/datasheet/RC0402FR-075K1L/107087.html; Supplier: LCSC; Type: Thick Film Resistor; Tolerance: ±1%; Power(Watts): 62.5mW; Voltage-Supply(Max): 50V; Temperature Coefficient: ±100ppm/℃; Operating Temperature: -55℃~+155℃
R5 = RC0402FR-07200RL: Type:Thick Film Resistor Resistance:200Ω Tolerance:±1% Tolerance:±1% Power(Watts):62.5mW Voltage-Supply(Max):50V Temperature Coefficient:±100ppm/℃ Temperature Coefficient:±100ppm/℃ Operating Temperature:-55℃~+155℃ Operating Temperature:-55℃~+155℃; LCSC Part Name: 厚膜电阻 200Ω ±1% 62.5mW; Supplier Part: C114764; Manufacturer: YAGEO(国巨); Supplier Footprint: 0402; Datasheet: https://item.szlcsc.com/datasheet/RC0402FR-07200RL/116008.html; Supplier: LCSC; Type: Thick Film Resistor; Tolerance: ±1%; Power(Watts): 62.5mW; Voltage-Supply(Max): 50V; Temperature Coefficient: ±100ppm/℃; Operating Temperature: -55℃~+155℃
R6 = RC0402FR-0740K2L: Type:Thick Film Resistor Resistance:40.2kΩ Tolerance:±1% Tolerance:±1% Power(Watts):62.5mW Voltage-Supply(Max):50V Temperature Coefficient:±100ppm/℃ Temperature Coefficient:±100ppm/℃ Operating Temperature:-55℃~+155℃ Operating Temperature:-55℃~+155℃; LCSC Part Name: 厚膜电阻 40.2kΩ ±1% 62.5mW; Supplier Part: C137983; Manufacturer: YAGEO(国巨); Supplier Footprint: 0402; Datasheet: https://item.szlcsc.com/datasheet/RC0402FR-0740K2L/149299.html; Supplier: LCSC; Type: Thick Film Resistor; Tolerance: ±1%; Power(Watts): 62.5mW; Voltage-Supply(Max): 50V; Temperature Coefficient: ±100ppm/℃; Operating Temperature: -55℃~+155℃
R7 = RC0402FR-07118KL: Type:Thick Film Resistor Resistance:118kΩ Tolerance:±1% Tolerance:±1% Power(Watts):62.5mW Voltage-Supply(Max):50V Temperature Coefficient:±100ppm/℃ Temperature Coefficient:±100ppm/℃ Operating Temperature:-55℃~+155℃ Operating Temperature:-55℃~+155℃; LCSC Part Name: 厚膜电阻 118kΩ ±1% 62.5mW; Supplier Part: C295873; Manufacturer: YAGEO(国巨); Supplier Footprint: 0402; Datasheet: https://item.szlcsc.com/datasheet/RC0402FR-07118KL/280290.html; Supplier: LCSC; Type: Thick Film Resistor; Tolerance: ±1%; Power(Watts): 62.5mW; Voltage-Supply(Max): 50V; Temperature Coefficient: ±100ppm/℃; Operating Temperature: -55℃~+155℃
R8 R11 R17-R20 R24 = RC0402FR-0710KL: Type:Thick Film Resistor Resistance:10kΩ Tolerance:±1% Tolerance:±1% Power(Watts):62.5mW Voltage-Supply(Max):50V Temperature Coefficient:±100ppm/℃ Temperature Coefficient:±100ppm/℃ Operating Temperature:-55℃~+155℃ Operating Temperature:-55℃~+155℃; LCSC Part Name: 厚膜电阻 10kΩ ±1% 62.5mW; Supplier Part: C60490; Manufacturer: YAGEO(国巨); Supplier Footprint: 0402; Datasheet: https://item.szlcsc.com/datasheet/RC0402FR-0710KL/61542.html; Supplier: LCSC; Type: Thick Film Resistor; Tolerance: ±1%; Power(Watts): 62.5mW; Voltage-Supply(Max): 50V; Temperature Coefficient: ±100ppm/℃; Operating Temperature: -55℃~+155℃
R9 R10 R14 R16 R28 = RC0402FR-07100KL: Type:Thick Film Resistor Resistance:100kΩ Tolerance:±1% Tolerance:±1% Power(Watts):62.5mW Voltage-Supply(Max):50V Temperature Coefficient:±100ppm/℃ Temperature Coefficient:±100ppm/℃ Operating Temperature:-55℃~+155℃ Operating Temperature:-55℃~+155℃; LCSC Part Name: 厚膜电阻 100kΩ ±1% 62.5mW; Supplier Part: C60491; Manufacturer: YAGEO(国巨); Supplier Footprint: 0402; Datasheet: https://item.szlcsc.com/datasheet/RC0402FR-07100KL/61543.html; Supplier: LCSC; Type: Thick Film Resistor; Tolerance: ±1%; Power(Watts): 62.5mW; Voltage-Supply(Max): 50V; Temperature Coefficient: ±100ppm/℃; Operating Temperature: -55℃~+155℃
R13 = RC0402FR-07205KL: Type:Thick Film Resistors Resistance: Tolerance:±1% Tolerance:±1% Power(Watts): Overload Voltage (Max): Temperature Coefficient:±100ppm/℃ Temperature Coefficient:±100ppm/℃ Operating Temperature Range:-55℃~+155℃ Operating Temperature Range:-55℃~+155℃; LCSC Part Name: 厚膜电阻 205kΩ ±1% 62.5mW; Supplier Part: C477669; Manufacturer: YAGEO(国巨); Supplier Footprint: 0402; Datasheet: https://atta.szlcsc.com/upload/public/pdf/source/20200715/C477669_32E25EE4E2F5525602D1707108E038B4.pdf; Supplier: LCSC; Type: Thick Film Resistors; Tolerance: ±1%; Temperature Coefficient: ±100ppm/℃; Operating Temperature Range: -55℃~+155℃
R15 = RC0402FR-0749K9L: Type:Thick Film Resistor Resistance:49.9kΩ Tolerance:±1% Tolerance:±1% Power(Watts):62.5mW Voltage-Supply(Max):50V Temperature Coefficient:±100ppm/℃ Temperature Coefficient:±100ppm/℃ Operating Temperature:-55℃~+155℃ Operating Temperature:-55℃~+155℃; LCSC Part Name: 厚膜电阻 49.9kΩ ±1% 62.5mW; Supplier Part: C137969; Manufacturer: YAGEO(国巨); Supplier Footprint: 0402; Datasheet: https://item.szlcsc.com/datasheet/RC0402FR-0749K9L/149285.html; Supplier: LCSC; Type: Thick Film Resistor; Tolerance: ±1%; Power(Watts): 62.5mW; Voltage-Supply(Max): 50V; Temperature Coefficient: ±100ppm/℃; Operating Temperature: -55℃~+155℃
R21 R22 R25 R32 R100 = RC0402FR-07220KL: Type:Thick Film Resistor Resistance:220kΩ Tolerance:±1% Tolerance:±1% Power(Watts):62.5mW Voltage-Supply(Max):50V Temperature Coefficient:±100ppm/℃ Temperature Coefficient:±100ppm/℃ Operating Temperature:-55℃~+155℃ Operating Temperature:-55℃~+155℃; LCSC Part Name: 厚膜电阻 220kΩ ±1% 62.5mW; Supplier Part: C138030; Manufacturer: YAGEO(国巨); Supplier Footprint: 0402; JLCPCB Part Class: Extended Part; Datasheet: https://item.szlcsc.com/datasheet/RC0402FR-07220KL/149346.html; Supplier: LCSC; Type: Thick Film Resistor; Tolerance: ±1%; Power(Watts): 62.5mW; Voltage-Supply(Max): 50V; Temperature Coefficient: ±100ppm/℃; Operating Temperature: -55℃~+155℃
R26 = RC0402FR-07750KL: Type:Thick Film Resistor Resistance:750kΩ Tolerance:±1% Tolerance:±1% Power(Watts):62.5mW Voltage-Supply(Max):50V Temperature Coefficient:±100ppm/℃ Temperature Coefficient:±100ppm/℃ Operating Temperature:-55℃~+155℃ Operating Temperature:-55℃~+155℃; LCSC Part Name: 厚膜电阻 750kΩ ±1% 62.5mW; Supplier Part: C137937; Manufacturer: YAGEO(国巨); Supplier Footprint: 0402; Datasheet: https://item.szlcsc.com/datasheet/RC0402FR-07750KL/149253.html; Supplier: LCSC; Type: Thick Film Resistor; Tolerance: ±1%; Power(Watts): 62.5mW; Voltage-Supply(Max): 50V; Temperature Coefficient: ±100ppm/℃; Operating Temperature: -55℃~+155℃
R27 = RC0201FR-071ML: Type:Thick Film Resistor Resistance:1MΩ Tolerance:±1% Tolerance:±1% Power(Watts):50mW Voltage-Supply(Max):25V Temperature Coefficient:±200ppm/℃ Temperature Coefficient:±200ppm/℃ Operating Temperature:-55℃~+125℃ Operating Temperature:-55℃~+125℃; LCSC Part Name: 厚膜电阻 1MΩ ±1% 50mW; Supplier Part: C295786; Manufacturer: YAGEO(国巨); Supplier Footprint: 0201; JLCPCB Part Class: Extended Part; Datasheet: https://item.szlcsc.com/datasheet/RC0201FR-071ML/280203.html; Supplier: LCSC; Type: Thick Film Resistor; Tolerance: ±1%; Power(Watts): 50mW; Voltage-Supply(Max): 25V; Temperature Coefficient: ±200ppm/℃; Operating Temperature: -55℃~+125℃
SW1-SW13 = TS-1095PS-A1B2-C3D2: Circuit:SPST Actuator Style:Round Button Operating Force:1.8N Mounting Type:Surface Mount,Vertical Length:6mm Width:6mm Switch Height:4.3mm with Bracket:Without Bracket Actuator/Cap Color:Black Termination Style:Gull Wing Life:-; LCSC Part Name: 6*6*4.3mm 立贴 轻触开关; Supplier Part: C2834918; Manufacturer: Yuandi(元迪); Supplier Footprint: SMD-4P,6x6mm; Datasheet: https://item.szlcsc.com/datasheet/TS-1095PS-A1B2-C3D2/2997598.html; Supplier: LCSC; Circuit: SPST; Actuator Style: Round Button; Operating Force: 1.8N; Mounting Type: Surface Mount,Vertical; Length: 6mm; Width: 6mm; Switch Height: 4.3mm; with Bracket: Without Bracket; Actuator/Cap Color: Black; Termination Style: Gull Wing
U1 = MP2607DL-LF-P: Li + LINEAR Charger WithSystem Power Path Management; GENERIC: False; ARTICLE CODE: MSR 946-MP2607DLLFP; ERP CODE: 10-*; MANUFACTURER: MPS; TMIN: -40; TMAX: 125; Library Name: KCP-2282-600
U2 = XC6194AA05ER-G: Power saving Push Button Load switch; GENERIC: False; TMIN: -40; ARTICLE CODE: MSR 865-XC6194AA05ER-G; ERP CODE: 10-*; MANUFACTURER: TOREX; TMAX: 85; Library Name: KCP-2282-600
U3 = NCP115AMX150TCG: LDO Regulator - High PSRR - 300mA - Input Voltage 1.7V/5.5V - Ouput Voltage 1.5V; GENERIC: False; TMAX: 85; ARTICLE CODE: MSR 863-NCP115AMX150TCG; ERP CODE: 10-*; ERP SF CODE: 11; TMIN: -40; MANUFACTURER: ON SEMI; Library Name: KCP-2282-600
U8 = NCP115AMX180TCG: LDO Regulator - High PSRR - 300mA - Input Voltage 1.7V/5.5V - Ouput Voltage 1.8V; TMAX: 85; ARTICLE CODE: MSR 863-NCP115AMX180TCG; GENERIC: Flase; ERP CODE: 10-*; ERP SF CODE: 11; MANUFACTURER: ON SEMI; TMIN: -40; Library Name: KCP-2282-600
U9 = NCP115AMX280TCG: LDO Regulator - High PSRR - 300mA - Input Voltage 1.7V/5.5V - Ouput Voltage 2.8V; GENERIC: Flase; ARTICLE CODE: MSR 863-NCP115AMX280TCG; ERP SF CODE: 11; ERP CODE: 10-*; MANUFACTURER: ON SEMI; TMIN: -40; TMAX: 85; Library Name: KCP-2282-600
C29 C30 = CL21B225KAFNNNE: Capacitance:2.2uF Tolerance:±10% Tolerance:±10% Voltage Rating:25V Temperature Coefficient:X7R; LCSC Part Name: 2.2uF ±10% 25V; Supplier Part: C19110; Manufacturer: SAMSUNG(三星); Supplier Footprint: 0805; Datasheet: https://item.szlcsc.com/datasheet/CL21B225KAFNNNE/19814.html; Supplier: LCSC; Tolerance: ±10%; Voltage Rating: 25V; Temperature Coefficient: X7R
CN1 = HX JN1.27-2x10 TP H4.9: Connector Type:IDC Header Pitch:1.27mm Number of Positions or Pins:2x10P Current Rating:1A Voltage Rating (Max):500V Holder Type:Surface Mount,Vertical Row Spacing:1.27mm Number of Rows:2 Number of PINs Per Row:10 Contact Material:Brass Contact Plating:Go; LCSC Part Name: 1.27mm 2x10P 排数:2 每排P数:10; Supplier Part: C42455947; Manufacturer: hanxia(韩下); Supplier Footprint: SMD,P=1.27mm; JLCPCB Part Class: Extended Part; Datasheet: https://item.szlcsc.com/datasheet/HX%2520JN1.27-2x10%2520TP%2520H4.9/44524770.html; Supplier: LCSC; Connector Type: IDC Header; Pitch: 1.27mm; Number of Positions or Pins: 2x10P; Current Rating: 1A; Voltage Rating (Max): 500V; Holder Type: Surface Mount,Vertical; Row Spacing: 1.27mm; Number of Rows: 2; Number of PINs Per Row: 10; Contact Material: Brass; Contact Plating: Gold; Operating Temperature: -40℃~+105℃; Color: Black
P210 = TC2030-MCP-NL: Connecteur Tag Connect - 6pts RJ45; ARTICLE CODE: DIG TC2030-MCP-NL-10-ND; ERP CODE: 10-*; ERP SF CODE: 11; MANUFACTURER: TAG CONNECT; TMAX: N/A; TMIN: N/A; GENERIC: False; Library Name: DbLibAltium
R23 = RC0402FR-0775KL: Type:Thick Film Resistor Resistance:75kΩ Tolerance:±1% Tolerance:±1% Power(Watts):62.5mW Voltage-Supply(Max):50V Temperature Coefficient:±100ppm/℃ Temperature Coefficient:±100ppm/℃ Operating Temperature:-55℃~+155℃ Operating Temperature:-55℃~+155℃; LCSC Part Name: 厚膜电阻 75kΩ ±1% 62.5mW; Supplier Part: C137935; Manufacturer: YAGEO(国巨); Supplier Footprint: 0402; JLCPCB Part Class: Extended Part; Datasheet: https://item.szlcsc.com/datasheet/RC0402FR-0775KL/149251.html; Supplier: LCSC; Type: Thick Film Resistor; Tolerance: ±1%; Power(Watts): 62.5mW; Voltage-Supply(Max): 50V; Temperature Coefficient: ±100ppm/℃; Operating Temperature: -55℃~+155℃
RST = TS-1071AS-A1B3-D4: Circuit:SPST Actuator Style:Round Button Operating Force:250gf Mounting Style:Brick nogging Switch Length:4mm Switch Width:3mm Switch Height:2mm Actuator/Cap Color:Blue Pin Style:SMDSplicing Mechanical Life:-; LCSC Part Name: 4*3*2mm 立贴 轻触开关; Supplier Part: C492861; Manufacturer: Yuandi(元迪); Supplier Footprint: SMD; JLCPCB Part Class: Extended Part; Datasheet: https://atta.szlcsc.com/upload/public/pdf/source/20200427/C492861_8410BFD0129EF5D536AF148AD1D8A09B.pdf; Supplier: LCSC; Circuit: SPST; Actuator Style: Round Button; Operating Force: 250gf; Mounting Style: Brick nogging; Switch Length: 4mm; Switch Width: 3mm; Switch Height: 2mm; Actuator/Cap Color: Blue; Pin Style: SMDSplicing
U5 = TLVH431AQDBZRG4: Output Type:Adjustable Input Voltage:- Input Voltage:- Output Voltage:1.24V~18V Output Voltage:1.24V~18V Output Current:70mA Tolerance:±1% Tolerance:±1% Temperature Coefficient:- Reference Type:parallel connection Supply Current:- Noise - 1/10Hz to 10Hz:-; Supplier Part: C2157199; Manufacturer: TI(德州仪器); Supplier Footprint: SOT-23; JLCPCB Part Class: Extended Part; Datasheet: https://www.ti.com/cn/lit/gpn/tlvh431; Supplier: LCSC; Output Type: Adjustable; Output Voltage: 1.24V~18V; Output Current: 70mA; Tolerance: ±1%; Reference Type: parallel connection; Operating Temperature: -40℃~+125℃@(Ta)
U12 = STM32H573VIT6: LCSC Part Name: Arm Cortex-M33 32位MCU+TrusZone+浮点运算单元（FPU）; Supplier Part: C7545121; Manufacturer: ST(意法半导体); Supplier Footprint: LQFP-100(14x14); Datasheet: https://item.szlcsc.com/datasheet/STM32H573VIT6/8655963.html; Supplier: LCSC
J2 = FFC2B35-12-G: 0.5mm Side entry Flat Flexible Cable Connector, 12pin,  bottom contacts; TMIN: -25; ARTICLE CODE: MSR 640-FFC2B35-12-G; GENERIC: False; ERP CODE: 10-*; ERP SF CODE: 14; MANUFACTURER: GCT; TMAX: 85; Library Name: KCP-2282-600
Q3 = RZM002P02T2L: Number:1 P-Channel Drain to Source Voltage:20V Current - Continuous Drain(Id):200mA RDS(on):1.2Ω@4.5V Pd - Power Dissipation:150mW Gate Threshold Voltage (Vgs(th)):1V@100uA Gate Charge(Qg):1.4nC@4.5V Input Capacitance(Ciss):115pF Reverse Transfer Capacita; LCSC Part Name: 1个P沟道 耐压:20V 电流:200mA; Supplier Part: C253531; Manufacturer: ROHM(罗姆); Supplier Footprint: SOT-723; JLCPCB Part Class: Extended Part; Datasheet: https://item.szlcsc.com/datasheet/RZM002P02T2L/248221.html; Supplier: LCSC; Number: 1 P-Channel; Drain to Source Voltage: 20V; Current - Continuous Drain(Id): 200mA; RDS(on): 1.2Ω@4.5V; Pd - Power Dissipation: 150mW; Gate Threshold Voltage (Vgs(th)): 1V@100uA; Gate Charge(Qg): 1.4nC@4.5V; Input Capacitance(Ciss): 115pF; Reverse Transfer Capacitance (Crss@Vds): 9pF; Type: P-Channel; Output Capacitance(Coss): 10pF
R12 = RC0402FR-0710RL: RES 10R 63mW 1% 0402; MANUFACTURER: YAGEO; ARTICLE CODE: MSR 603-RC0402FR-0710RL; GENERIC: True; TMIN: -55; TMAX: 150; Design Item ID: R-EU-R10-1%-0402; Library Name: KCP-2282-600
R33 = RC0402FR-0711K5L: Type:Thick Film Resistors Resistance: Tolerance:±1% Tolerance:±1% Power(Watts): Overload Voltage (Max): Temperature Coefficient:±100ppm/℃ Temperature Coefficient:±100ppm/℃ Operating Temperature Range:-55℃~+155℃ Operating Temperature Range:-55℃~+155℃; LCSC Part Name: 厚膜电阻 11.5kΩ ±1% 62.5mW; Supplier Part: C295874; Manufacturer: YAGEO(国巨); Supplier Footprint: 0402; JLCPCB Part Class: Extended Part; Datasheet: https://atta.szlcsc.com/upload/public/pdf/source/20180927/C295883_E8D83085EA81BD7DE0B2B681138C15EE.pdf; Supplier: LCSC; Type: Thick Film Resistors; Tolerance: ±1%; Temperature Coefficient: ±100ppm/℃; Operating Temperature Range: -55℃~+155℃
T1 = NTR3C21NZT1G: Drain to Source Voltage:20V Current - Continuous Drain(Id):6.5A RDS(on):22mΩ@4.5V,6.5A Pd - Power Dissipation:1.4W Gate Threshold Voltage (Vgs(th)):1V Gate Charge(Qg):10nC@4.5V Input Capacitance(Ciss):1.16nF@10V Reverse Transfer Capacitance (Crss@Vds):140; LCSC Part Name: 耐压:20V 电流:6.5A; Supplier Part: C5123937; Manufacturer: TECH PUBLIC(台舟); Supplier Footprint: SOT-23; JLCPCB Part Class: Extended Part; Datasheet: https://item.szlcsc.com/datasheet/NTR3C21NZT1G/5718404.html; Supplier: LCSC; Drain to Source Voltage: 20V; Current - Continuous Drain(Id): 6.5A; RDS(on): 22mΩ@4.5V,6.5A; Pd - Power Dissipation: 1.4W; Gate Threshold Voltage (Vgs(th)): 1V; Gate Charge(Qg): 10nC@4.5V; Input Capacitance(Ciss): 1.16nF@10V; Reverse Transfer Capacitance (Crss@Vds): 140pF@10V; Operating Temperature: -55℃~+150℃
U7 = ESDS312DBVR: Reverse Stand-Off Voltage (Vrwm):3.6V Maximum Clamping Voltage:6.5V Peak Pulse Current (Ipp):25A@8/20us Peak Pulse Power Dissipation (Ppp):170W Breakdown Voltage:4.5V Number of Lines:Dual channel Operating Temperature:-40℃~+125℃@(Ta) Operating Temperature; Supplier Part: C1976412; Manufacturer: TI(德州仪器); Supplier Footprint: SOT-23-5; Datasheet: https://www.ti.com/cn/lit/gpn/esds314; Supplier: LCSC; Reverse Stand-Off Voltage (Vrwm): 3.6V; Maximum Clamping Voltage: 6.5V; Peak Pulse Current (Ipp): 25A@8/20us; Peak Pulse Power Dissipation (Ppp): 170W; Breakdown Voltage: 4.5V; Number of Lines: Dual channel; Operating Temperature: -40℃~+125℃@(Ta); Type: ESD
X1 = HC-FPC-05-09-24RLTAG: 0.5mm Side entry Flat Flexible Cable Connector, 12pin,  bottom contacts; TMIN: -25; ARTICLE CODE: LCSC C5213757; GENERIC: False; ERP CODE: 10-*; ERP SF CODE: 14; MANUFACTURER: HCTL; TMAX: 85; Library Name: KCP-2282-600
Mire Top 1 Mire Top 2 = DNI: Mire; Design Item ID: Mire; Library Name: PcbLibPDCi - NonValide
U10 = 5145300-3: Card Connection Mode:- Card Type:Smart Card Connector Type:Connector and Ejector Card Detection:- Supplementary Features:With Locating Post Height Above Board:3.65mm Operating Temperature:-40℃~+90℃ Operating Temperature:-40℃~+90℃; LCSC Part Name: Smart卡 卡座; Supplier Part: C5261038; Manufacturer: TE Connectivity(泰科电子); Supplier Footprint: SMD; Datasheet: https://item.szlcsc.com/datasheet/5145300-3/5983702.html; Supplier: LCSC; Card Type: Smart Card; Connector Type: Connector and Ejector; Supplementary Features: With Locating Post; Height Above Board: 3.65mm; Operating Temperature: -40℃~+90℃

## Nets
GND: C1.1 C2.2 C3.2 C4.1 C5.1 C6.1 C7.1 C9.2 C10.1 C11.1 C12.1 C13.1 C14.1 C15.1 C16.1 C17.1 C19.2 C21.1 C23.1 C24.2 C25.1 C26.1 C27.2 C29.1 C30.1 C31.1 C32.1 C33.1 C34.1 C35.1 C36.1 C37.1 C38.1 C39.1 C40.2 C41.1 C42.1 C44.1 C45.1 C46.1 C47.1 C48.1 C52.1 C53.1 C54.1 C300.1 C301.1 C303.1 CN1.4 CN1.6 CN1.8 CN1.10 CN1.12 CN1.14 CN1.16 CN1.18 CN1.20 D1.2(GND) D6.2(A) GND.1(PT) GND4.1(PT) IC2.2(GND) J2.1 J2.5 J2.12 J6.1 J6.4 J8.A1_B12(GND) J8.B1_A12(GND) J8.S1(SHELL) J8.S2(SHELL) J8.S3(SHELL) J8.S4(SHELL) JGND.1(PT) M.1(PT) P210.6 Q5.2(S) Q6.2(S) Q7.2(S) Q8.2(S) Q9.2(S) R1.1 R2.2 R3.2 R4.1 R7.1 R10.1 R14.1 R15.1 R17.1 R18.1 R25.1 R28.1 R100.1 RST.1 T1.2(S) U1.3(MODE) U1.7(GND) U1.TH_PAD(GND) U2.5(GND) U2.6(TEST) U2.TH_PAD U3.2(GND) U3.5(EP) U7.2(GND) U8.2(GND) U8.5(EP) U9.2(GND) U9.5(EP) U10.C5 U10.C10 U12.10(VSS) U12.19(VSSA) U12.20(VREF-) U12.27(VSS) U12.49(VSS) U12.74(VSS) U12.99(VSS) X1.0 X1.2 X1.15
V1P5: 1V5.1(PT) C10.2 C301.2 U3.1(OUT) X1.10
V1P8: 1V8.1(PT) C12.2 C14.2 C15.2 C16.2 C17.2 C31.2 C32.2 C33.2 C34.2 C35.2 C36.2 C37.2 C38.2 C44.2 C45.2 C52.2 C53.2 J1V8.1(PT) J2.8 P210.1 Q3.2(S) R11.2 R19.1 R24.2 R32.2 U8.1(OUT) U12.11(VDD) U12.28(VDD) U12.50(VDD) U12.75(VDD) U12.100(VDD) X1.11
V2P8: 2V8.1(PT) C300.2 C303.2 U9.1(OUT) X1.4
V3P0: C7.2 C11.2 C23.2 C24.1 C25.2 C28.2 C41.2 C42.2 C46.2 C47.2 C48.2 CN1.1 CN1.2 J2.9 L1.2 R12.2 R13.2 R16.2 U3.4(IN) U8.4(IN) U9.4(IN) U12.21(VREF+) U12.22(VDDA) U12.73(VDDUSB) V3P0.1(PT)
VBAT: C39.2 R17.2 R22.1 U5.3(A) U12.6(VBAT)
BAT: C4.2 F2.2 U1.1(BAT) U1.2(BAT)
BAT_BSI: J6.2 J6.5
BL_A: J2.10 R12.1
BL_K: J2.11 T1.3(D)
CAM_D0: U12.68(PA9) X1.19
CAM_D1: U12.64(PC7) X1.21
CAM_D2: U12.54(PB15) X1.22
CAM_D3: U12.66(PC9) X1.20
CAM_D4: U12.79(PC11) X1.18
CAM_D5: U12.92(PB6) X1.16
CAM_D6: U12.95(PB8) X1.14
CAM_D7: U12.90(PB4) X1.12
CAM_HS: U12.29(PA4) X1.9
CAM_I2C_SCL: R11.1 U12.47(PB10)
CAM_I2C_SDA: R24.1 U12.51(PB12)
CAM_PCLK: U12.31(PA6) X1.17
CAM_PD: U12.26(PA3) X1.8
CAM_RST: U12.25(PA2) X1.6
CAM_SCL: X1.5
CAM_SDA: X1.3
CAM_VS: U12.93(PB7) X1.7
CAM_XCLK: U12.67(PA8) X1.13
CC1: J8.A5(CC1) R2.1
CC2: J8.B5(CC2) R3.1
JTCK_SWCLK: CN1.9 JSWC.1(PT) P210.4 U12.76(PA14)
JTDI: JTDI.1(PT) U12.77(PA15)
JTDO_SWO: CN1.13 JTDO.1(PT) U12.89(PB3)
JTMS_SWDIO: CN1.7 JSWD.1(PT) P210.2 U12.72(PA13)
KBD_C0: SW9.2 SW10.2 SW11.2 SW12.2 U12.17(PC2)
KBD_C1: SW5.2 SW6.2 SW7.2 SW8.2 U12.16(PC1)
KBD_C2: SW1.2 SW2.2 SW3.2 SW4.2 U12.15(PC0)
KBD_R0: SW4.4 SW8.4 SW12.4 U12.37(PB2)
KBD_R1: SW3.4 SW7.4 SW11.4 U12.36(PB1)
KBD_R2: SW2.4 SW6.4 SW10.4 U12.35(PB0)
KBD_R3: SW1.4 SW5.4 SW9.4 U12.34(PC5)
MCU_BOOT0: R18.2 U12.94(BOOT0)
MCU_OSC_IN: U12.12(PH0-OSC_IN)
MCU_OSC_OUT: U12.13(PH1-OSC_OUT)
MCU_RST: CN1.3 CN1.15 JRST.1(PT) P210.3
MCU_SC_PRES: C54.2 Q3.3(D) R33.2 U7.5(I/O2) U10.C1 U12.78(PC10)
MCU_USB2_N: D1.1(I/O1) D1.6(I/O1) J8.A7(DN1) J8.B7(DN2) U12.70(PA11)
MCU_USB2_P: D1.3(I/O2) D1.4(I/O2) J8.A6(DP1) J8.B6(DP2) U12.71(PA12)
PWR_CAM_EN: R28.2 U3.3(EN) U9.3(EN) U12.83(PD2)
PWR_HALT_REQ: D5.2(A) U12.33(PC4)
PWR_KILL: R10.2 U2.7(SHDN) U12.53(PB14)
RS_RST: U7.3(NC) U10.C2 U12.69(PA10)
SC_PRES_SW: D4.1(C) Q4.1(G) Q5.1(G) Q9.1(G) R27.1 SC_SW.1(PT) U10.C9
SC_UART_CLK: U7.1(NC) U10.C3 U12.65(PC8)
SC_UART_TX: R33.1 U7.4(I/O1) U10.C7 U12.63(PC6)
SCR_BL_PWM: R14.2 T1.1(G) U12.30(PA5)
SCR_D/C: J2.6 U12.23(PA0)
SCR_RST: J2.2 U12.24(PA1)
SCR_SPI_MOSI: J2.3 U12.32(PA7)
SCR_SPI_SCK: J2.4 U12.80(PC12)
SCR_TE: J2.7
SYS_PG: IC2.1(EN) R9.1 U2.4(PG)
USB_5V: F1.1 J8.A4_B9(VBUS) J8.B4_A9(VBUS) VIN.1(PT)
VSYS: C5.2 C6.2 C9.1 Q4.3(D) R5.2 R26.2 R27.2 U1.13(SYS) U1.14(SYS) U2.1(VIN) VSYS.1(PT)
VSYS_SWITCHED: C13.2 C19.1 C21.2 IC2.4(VIN) R9.2 R23.2 U2.8(VOUT) U5.2(C) VSW.1(PT)
VUSB: C1.2 C2.1 C26.2 C27.1 D1.5(VBUS) F1.2 R6.2 R8.2 U1.11(IN) U1.12(IN)
VUSB_OK: D3.2(A) U12.7(PC13)
~CEB~: D3.1(K) Q8.3(D) U1.6(~CEB~)
$1N22: R1.2 R6.1 R7.2 U1.8(NTC)
$1N29: B.1(PT) F2.1 J6.3 J6.6 VBAT.1(PT)
$1N61: IC2.3(L) L1.1
$1N2048: D2.1(C) U1.9(~STAT2~)
$2N6611: Rx4.1(PT) U12.8(PC14-OSC32_IN)
$2N6613: Tx4.1(PT) U12.9(PC15-OSC32_OUT)
$2N8175: R22.2 R23.1 U5.1(REF)
Net-(C3-1): C3.1 U1.5(TMR)
Net-(C8-1): C8.1 Q5.3(D) R21.1
Net-(C8-2): C8.2 D6.1(C) R20.2
Net-(C28-1): C28.1 IC2.5(FB) R13.1 R15.2
Net-(C29-2): C29.2 U12.98(VCAP)
Net-(C30-2): C30.2 U12.48(VCAP)
Net-(C40-1): C40.1 R19.2 RST.2 U12.14(NRST)
Net-(D2-2): D2.2(A) R5.1
Net-(D4-2): D4.2(A) Q3.1(G) R32.1
Net-(D5-1): D5.1(C) Q6.3(D) R26.1 SW.1(PT) SW13.1 SW13.2 U2.3(SW)
Net-(Q4-2): Q4.2(S) Q7.1(G) Q9.3(D) R20.1
Net-(Q6-1): Q6.1(G) R21.2 R25.2
Net-(Q7-3): Q7.3(D) SW13.3 SW13.4
Net-(Q8-1): Q8.1(G) R8.1 R100.2
Net-(R4-2): R4.2 U1.4(ICHSET)
Net-(R16-1): R16.1 U8.3(EN)

Not connected (* = marked no-connect by the designer): CN1 5 11 17 19; J8 A8(SBU1) B8(SBU2); P210 5; SW1 1 3; SW2 1 3; SW3 1 3; SW4 1 3; SW5 1 3; SW6 1 3; SW7 1 3; SW8 1 3; SW9 1 3; SW10 1 3; SW11 1 3; SW12 1 3; U1 10(~STAT1~); U2 2(NC); U10 C4 C6 C8; U12 1(PE2) 2(PE3) 3(PE4) 4(PE5) 5(PE6) 18(PC3) 38(PE7) 39(PE8) 40(PE9) 41(PE10) 42(PE11) 43(PE12) 44(PE13) 45(PE14) 46(PE15) 52(PB13) 55(PD8) 56(PD9) 57(PD10) 58(PD11) 59(PD12) 60(PD13) 61(PD14) 62(PD15) 81(PD0) 82(PD1) 84(PD3) 85(PD4) 86(PD5) 87(PD6) 88(PD7) 91(PB5) 96(PB9) 97(PE0); X1 1 23 24

## Notes on the sheets
sheet 1
- BSI identification pin
  not used
- Li Ion BL4B battery (650mA)
- BATTERIY MANAGEMENT
- USB POWER INPUT & DATA
- USB Mode
- 15mA (VSYS=5V)
  On when charging
- + ERTJ0EP473â–¡M datasheet:
    - RT_25=47k
    - 0402 case:
      - RT_5=2.574x    => 128k78
      - RT_45=0.4266x  => 20k
  + MP2607 datasheet:
    - RT2=0.3*RT_45*RT_5/(0.12*RT_5-0.42*RT_45)
    - RT1=0.667*(RT2*RT_5/(RT2+RT_5))
  RT2=118k
  RT1=40.2k
- Rchg=1800x1.260/Ichg
  Rchg=5.1k for Ichg=445mA
- Ctmr=(2uA+Ichg/36000)/
            1.1hours/
           (2uA+1A/36000)x
           1uF*Ttmr_f
  Ctmr=5.45uF for Ttmr_f=6hours
  Dielectic: COG, X7R, X5R
- CEB disabled when no USB power
  in order to reduce SYS Reverse to
  AT Switch Leakage current to 1uA
  Internally pulled up
- When SC Switch actived => the VSYS_SWITCHED goes to ON after a time defined by R20,C8, R21 and R22
- POWER SWITCH
- 3V05 MAKER
- 1V8..6V@1A
- TLV62569 / SY8088?
- FB=0.6V
- From Card Reader Switch
- Power on pulse on
  SmartCard insertion
  Dielectic: COG, X7R, X5R
- When SC Switch disabled => the VSYS_SWITCHED goes to ON when S3 is actived
- 01 POWER
- When SC Switch actived => S3 is disable
- 02 MCU MANAGEMENT
- C8 -> 0603 => Rationalisation des refs
- 03 PERIPHERALS
- 04
- 05
- 07
- 2V8 MAKER
- 1V5 MAKER
- 1V8 MAKER
- CAMERA
- Image Sensor (120mW)
- CAMERA
- System (600mW max.)
sheet 2
- MCU PIN OUT  - PA PB PC PC
- VRef = 2V5
- Capacitors to be distributed closed to the VDD supply pins
- Capacitors to be placed
  closed to VDDA supply pins
- MCU PROGRAMMING PORT (JTAG)
sheet 3
- KEYBOARD MATRIX
- SCREEN CONNECTION
- CAMERA CONNECTION
- CS: Active low
- HREF have to be validated
- NC
- DGND
- TE: Not Used
- SIO_D
- AVDD
- SIO_C
- RESET
- VSYNC
- PWDN
- HREF
- DVDD
- DOVDD
- Y9
- MCLK
- Y8
- DGND
- Y7
- PCLK
- Y6
- Y2
- Y5
- Y3
- Y4
- NC
- NC
- SMART CARD READER
- Prevents current from flowing
  from SC_PRES_SW to V3P0 (off)
- 16/02/2024 10:59:17
sheet 4
- 01 POWER
- 02 DETECT
- 03 MEASUREMENT
- 04 CPU
- 05 INDICATORS
- 06
- 07
